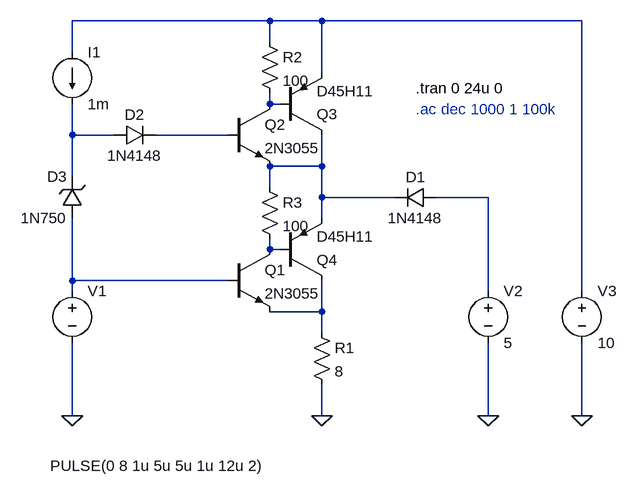
[diagram p0: schematic ClaseG_Basico_v2.asc]
ClaseG_Basico_v2.asc, the LTspice schematic file:
Version 4
SHEET 1 1180 680
WIRE 384 -48 80 -48
WIRE 464 -48 384 -48
WIRE 864 -48 464 -48
WIRE 384 -16 384 -48
WIRE 80 0 80 -48
WIRE 464 32 464 -48
WIRE 384 80 384 64
WIRE 400 80 384 80
WIRE 80 128 80 80
WIRE 144 128 80 128
WIRE 320 128 208 128
WIRE 464 176 464 128
WIRE 464 176 384 176
WIRE 80 192 80 128
WIRE 384 208 384 176
WIRE 464 224 464 176
WIRE 576 224 464 224
WIRE 720 224 640 224
WIRE 464 256 464 224
WIRE 384 304 384 288
WIRE 400 304 384 304
WIRE 80 352 80 256
WIRE 320 352 80 352
WIRE 80 368 80 352
WIRE 720 368 720 224
WIRE 864 368 864 -48
WIRE 464 400 464 352
WIRE 464 400 384 400
WIRE 464 432 464 400
WIRE 80 560 80 448
WIRE 464 560 464 512
WIRE 720 560 720 448
WIRE 864 560 864 448
FLAG 464 560 0
FLAG 80 560 0
FLAG 720 560 0
FLAG 864 560 0
DATAFLAG 720 224 "$"
SYMBOL npn 320 304 R0
SYMATTR InstName Q1
SYMATTR Value 2N3055
SYMBOL npn 320 80 R0
SYMATTR InstName Q2
SYMATTR Value 2N3055
SYMBOL diode 640 208 R90
WINDOW 0 0 32 VBottom 2
WINDOW 3 32 32 VTop 2
SYMATTR InstName D1
SYMATTR Value 1N4148
SYMBOL diode 144 144 R270
WINDOW 0 32 32 VTop 2
WINDOW 3 0 32 VBottom 2
SYMATTR InstName D2
SYMATTR Value 1N4148
SYMBOL zener 96 256 R180
WINDOW 0 24 64 Left 2
WINDOW 3 24 0 Left 2
SYMATTR InstName D3
SYMATTR Value 1N750
SYMBOL voltage 80 352 R0
WINDOW 3 -34 285 Left 2
SYMATTR Value PULSE(0 8 1u 5u 5u 1u 12u 2)
SYMATTR InstName V1
SYMATTR Value2 AC 1
SYMBOL voltage 720 352 R0
SYMATTR InstName V2
SYMATTR Value 5
SYMBOL voltage 864 352 R0
SYMATTR InstName V3
SYMATTR Value 10
SYMBOL res 448 416 R0
SYMATTR InstName R1
SYMATTR Value 8
SYMBOL current 80 0 R0
SYMATTR InstName I1
SYMATTR Value 1m
SYMBOL pnp 400 128 M180
SYMATTR InstName Q3
SYMATTR Value D45H11
SYMBOL pnp 400 352 M180
SYMATTR InstName Q4
SYMATTR Value D45H11
SYMBOL res 368 -32 R0
SYMATTR InstName R2
SYMATTR Value 100
SYMBOL res 368 192 R0
SYMATTR InstName R3
SYMATTR Value 100
TEXT 608 56 Left 2 !.tran 0 24u 0
TEXT 608 88 Left 2 ;.ac dec 1000 1 100k

The netlist it stands for:
* ClaseG_Basico_v2.asc
Q1 N007 N008 N009 0 2N3055
Q2 N002 N004 N005 0 2N3055
D1 N006 N005 1N4148
D2 N003 N004 1N4148
D3 N008 N003 1N750
V1 N008 0 PULSE(0 8 1u 5u 5u 1u 12u 2) AC 1
V2 N006 0 5
V3 N001 0 10
R1 N009 0 8
I1 N001 N003 1m
Q3 N005 N002 N001 0 D45H11
Q4 N009 N007 N005 0 D45H11
R2 N001 N002 100
R3 N005 N007 100
.model D D
.lib standard.dio
.model NPN NPN
.model PNP PNP
.lib standard.bjt
.tran 0 24u 0
* .ac dec 1000 1 100k
.backanno
.end